# EAGLE design SOT-23-5_to_breadboard (EAGLE 8.5.1)
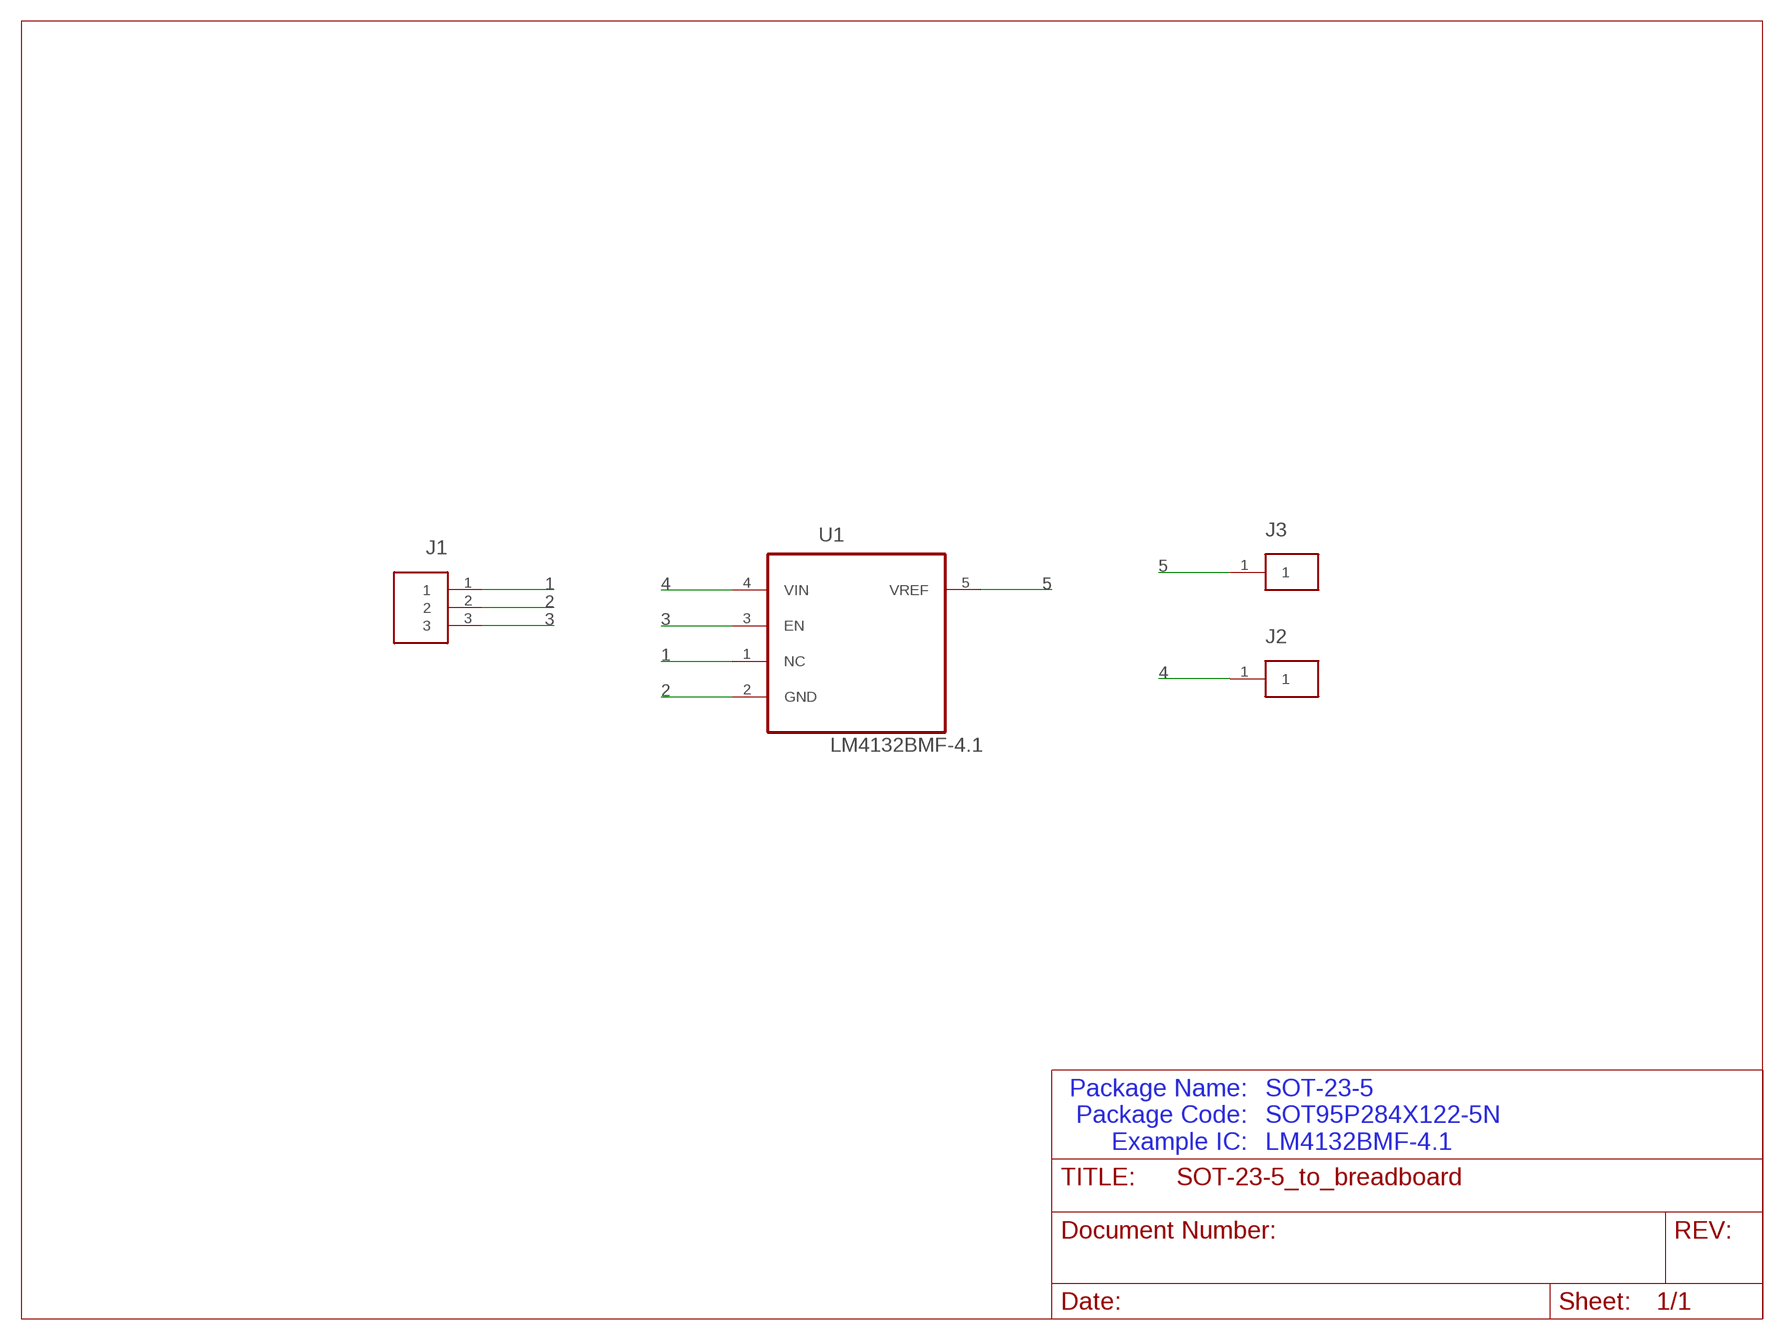
[diagram p0: schematic, sheet 1]

## Parts
J1  CONNECTOR_3  [68000-103HLF]
J2  CONNECTOR_1-NO_SQUARE  [68000-101HLF_NO_SQUARE]
J3  CONNECTOR_1-NO_SQUARE  [68000-101HLF_NO_SQUARE]
U1  LM4132BMF-4.1  [SOT95P284X122-5N]

## Nets
1: J1.1 U1.1(NC)
2: J1.2 U1.2(GND)
3: J1.3 U1.3(EN)
4: J2.1 U1.4(VIN)
5: J3.1 U1.5(VREF)

## Notes on the sheet
- Package Name:
  Package Code:
  Example IC:
- SOT-23-5
  SOT95P284X122-5N
  LM4132BMF-4.1

## Library data of the parts
J1 = SnapEDA:CONNECTOR_3
J2 J3 = SnapEDA:CONNECTOR_1
U1 = SnapEDA:LM4132BMF-4.1: Precision Low Dropout Voltage Reference; AVAILABILITY: Warning; DESCRIPTION: Voltage Reference, Precision, Low Dropout, Series - Fixed, LM4132 Series, 4.096V, SOT-23-5; MF: Texas Instruments; MP: LM4132BMF-4.1; PACKAGE: SOT-23-5 Texas Instruments; PRICE: None

## Board
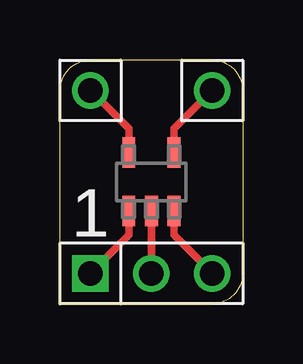
[diagram p1: board, top side]
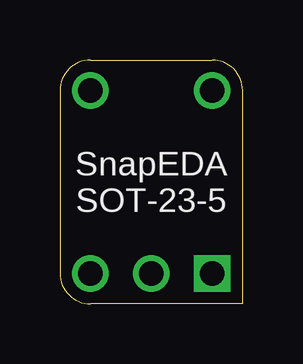
[diagram p2: board, bottom side, seen from below]

Size 7.63 x 10.16 mm. Coordinates in mm from the lower left corner, seen from the top.
Outline: 1.3,10.16 6.36,10.16 arc-90 7.63,8.89 arc0 7.63,1.27 arc-90 6.36,0
Outline: 6.34,0 0.01,0 arc0 0.01,8.89 arc-90 1.28,10.16
Copper layers (1*16): Top 0.035559375mm / dielectric 1.6mm / Bottom 0.035559375mm
Design rules "oshpark-2layer": minimum track width 6mil, minimum drill 10mil, track to track 6mil, track to pad 6mil, pad to pad 6mil, via to via 6mil, smd to smd 6mil, copper to edge 15mil, drill to drill 6mil, minimum pad ring 5mil, minimum via ring 5mil, stop-mask expansion 2.5mil, vias tented up to drill 0mil, thermal gap 10mil

### Footprints (pad centres in the part's own frame; a part is rotated, then mirrored left to right if it is on the bottom)
68000-103HLF = drill 1.016 square: 1 0,0 | drill 1.016: 2 2.54,0; 3 5.08,0
68000-101HLF_NO_SQUARE = drill 1.016: 1 0,0
SOT95P284X122-5N = smd 1.27 x 0.533: 1 -1.219,0.94; 2 -1.219,0; 3 -1.219,-0.94; 4 1.219,-0.94; 5 1.219,0.94

### Placement (x,y rotation side)
J1  1.28,1.27 0 top
J2  6.36,8.89 0 top
J3  1.28,8.89 0 top
U1  3.82,5.08 90 top

### Tracks (layer width: path | path; a pad name or v marks a point on that pad's centre or on a via)
1
  Top 0.305: U1.1 2.88,2.87 J1.1
2
  Top 0.305: U1.2 J1.2
3
  Top 0.305: U1.3 4.76,2.87 J1.3
4
  Top 0.305: U1.4 4.76,7.29 J2.1
5
  Top 0.305: U1.5 2.88,7.29 J3.1

### Text on the board
tPlace: 1
bPlace: SnapEDA / SOT-23-5